# Altium schematic sheet Schematic.SchDoc
size A4; SheetNumber: 1; SheetTotal: 1
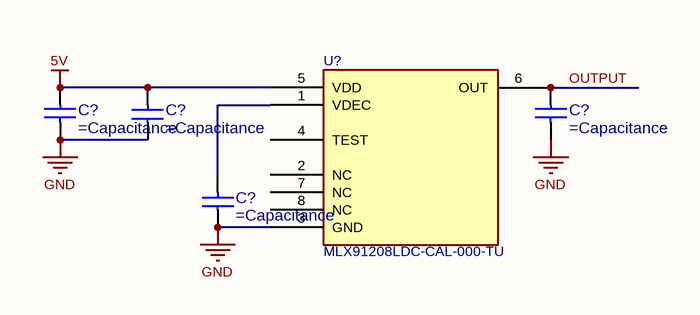
[diagram p0: Schematic.SchDoc]

## Parts
(Parts that share a designator on the sheet are numbered #1, #2 ... from top to bottom, then left to right.)
C?#1  (no value)  [C0402]
C?#2  (no value)  [C0402]
C?#3  (no value)  [C0402]
C?#4  (no value)  [C0402]
U?  MLX91208LDC-CAL-000-TU  [SOIC8]

## Nets
5V: C?#1.1 C?#3.2 U?.5(VDD)
GND: C?#1.2 C?#2.2 C?#3.1 C?#4.1 U?.3(GND)
OUTPUT: C?#2.1 U?.6(OUT)
NetC?#4_2: C?#4.2 U?.1(VDEC)

Not connected (* = marked no-connect by the designer): U? 2(NC) 4(TEST) 7(NC) 8(NC)

## Library data of the parts
C?#1 = CAP0402-4.7uF-10V: Ceramic Capacitor, Ceramic, 10V, 10% +Tol, 10% -Tol, X5R, 15% TC, 4.7uF, Surface Mount, 0402; Manufacturer: Yageo Group; Manufacturer Part Number: CC0402KRX5R6BB475; Capacitance: 4.7µF; Value: 4.7µF; Temperature Coefficient: 30ppm/°C; Supplier 1: DigiKey; Supplier Part Number 1: 13-CC0402KRX5R6BB475DKR-ND; Supplier: DigiKey; Supplier Part Number: 13-CC0402KRX5R6BB475DKR-ND; RoHS: Compliant; Category: Ceramic Capacitors; Pricing: 1=0,11, 10=0,063, 50=0,0438, 100=0,038, 500=0,02808, 1000=0,02628, 2500=0,02393, 5000=0,02325 (USD); Case/Package: 0402; China RoHS: Compliant; Dielectric: X5R; Dielectric Material: Ceramic; Halogen Free: Halogen Free; Height: 500µm; Lead Free: Lead Free; Length: 1mm; Lifecycle Status: Production; Material: Ceramic; Max Operating Temperature: 85°C; Min Operating Temperature: -55°C; Mounting Technology: Surface Mount; Number of Terminals: 2; REACH SVHC: Yes; Voltage Rating: 10V; Voltage Rating (DC): 10V; Width: 500µm; ComponentLink1URL: https://datasheet.octopart.com:443/CC0402KRX5R6BB475-Yageo-datasheet-170350636.pdf?src-supplier=Future+Electronics; ComponentLink1Description: https://datasheet.octopart.com:443/CC0402KRX5R6BB475-Yageo-datasheet-170350636.pdf?src-supplier=Future+Electronics; ComponentLink2URL: https://datasheet.octopart.com:443/CC0402KRX5R6BB475-Yageo-datasheet-82528541.pdf?src-supplier=Future+Electronics; ComponentLink2Description: https://datasheet.octopart.com:443/CC0402KRX5R6BB475-Yageo-datasheet-82528541.pdf?src-supplier=Future+Electronics; ComponentLink3URL: https://datasheet.octopart.com:443/CC0402KRX5R6BB475-Yageo-datasheet-78855684.pdf?src-supplier=Upverter; ComponentLink3Description: https://datasheet.octopart.com:443/CC0402KRX5R6BB475-Yageo-datasheet-78855684.pdf?src-supplier=Upverter; ComponentLink4URL: https://datasheet.octopart.com:443/CC0402KRX5R6BB475-Yageo-Group-datasheet-189192896.pdf?src-supplier=TME; ComponentLink4Description: https://datasheet.octopart.com:443/CC0402KRX5R6BB475-Yageo-Group-datasheet-189192896.pdf?src-supplier=TME; ComponentLink5URL: https://datasheet.octopart.com:443/CC0402KRX5R6BB475-Yageo-datasheet-182029407.pdf?src-supplier=Newark; ComponentLink5Description: https://datasheet.octopart.com:443/CC0402KRX5R6BB475-Yageo-datasheet-182029407.pdf?src-supplier=Newark; ComponentLink6URL: https://datasheet.octopart.com:443/CC0402KRX5R6BB475-Yageo-datasheet-158238148.pdf?src-supplier=Newark; ComponentLink6Description: https://datasheet.octopart.com:443/CC0402KRX5R6BB475-Yageo-datasheet-158238148.pdf?src-supplier=Newark; ComponentLink7URL: https://datasheet.octopart.com:443/CC0402KRX5R6BB475-Yageo-Group-datasheet-145016144.pdf?src-supplier=ODG+(Origin+Data+Global); ComponentLink7Description: https://datasheet.octopart.com:443/CC0402KRX5R6BB475-Yageo-Group-datasheet-145016144.pdf?src-supplier=ODG+(Origin+Data+Global); ComponentLink8URL: https://datasheet.octopart.com/CC0402KRX5R6BB475-Yageo-datasheet-86397281.pdf; ComponentLink8Description: https://datasheet.octopart.com/CC0402KRX5R6BB475-Yageo-datasheet-86397281.pdf; ComponentLink9URL: http://sigma.octopart.com:80/rohs_statement/Yageo-company-2.pdf?src-supplier=Compliance+Statements; ComponentLink9Description: http://sigma.octopart.com:80/rohs_statement/Yageo-company-2.pdf?src-supplier=Compliance+Statements; ComponentLink10URL: http://sigma.octopart.com:80/conflict_mineral_statement/Yageo-company-3.pdf?src-supplier=Compliance+Statements; ComponentLink10Description: http://sigma.octopart.com:80/conflict_mineral_statement/Yageo-company-3.pdf?src-supplier=Compliance+Statements
C?#2 = CAP0402-6.8nF-25V: Multilayer Ceramic Capacitors MLCC - SMD/SMT 25V 6800pF X7R 0402 10% AEC-Q200; Manufacturer: KEMET; Manufacturer Part Number: C0402C682K3RACAUTO; Capacitance: 6.8nF; Value: 6.8nF; Supplier 1: DigiKey; Supplier Part Number 1: 399-C0402C682K3RACAUTOCT-ND; Supplier: DigiKey; Supplier Part Number: 399-C0402C682K3RACAUTOCT-ND; RoHS: Compliant; Category: Ceramic Capacitors; Stock: 9600; Pricing: 1=0,26, 10=0,122, 50=0,075, 100=0,0595, 500=0,0515 (USD); Case/Package: 0402; China RoHS: Compliant; Dielectric: X7R; Dielectric Material: Ceramic; Height: 500µm; Length: 1mm; Lifecycle Status: Production; Material: Ceramic; Max Operating Temperature: 125°C; Min Operating Temperature: -55°C; Mounting Technology: Surface Mount; Pins: 2; Number of Terminals: 2; REACH SVHC: Yes; Voltage Rating: 25V; Voltage Rating (DC): 25V; Width: 500µm; ComponentLink1URL: https://datasheet.octopart.com:443/C0402C682K3RACAUTO-KEMET-datasheet-178087915.pdf?src-supplier=IHS; ComponentLink1Description: https://datasheet.octopart.com:443/C0402C682K3RACAUTO-KEMET-datasheet-178087915.pdf?src-supplier=IHS; ComponentLink2URL: https://datasheet.octopart.com:443/C0402C682K3RACAUTO-KEMET-datasheet-137357759.pdf?src-supplier=Upverter; ComponentLink2Description: https://datasheet.octopart.com:443/C0402C682K3RACAUTO-KEMET-datasheet-137357759.pdf?src-supplier=Upverter; ComponentLink3URL: https://datasheet.octopart.com:443/C0402C682K3RACAUTO-KEMET-datasheet-153706760.pdf?src-supplier=Electro+Sonic; ComponentLink3Description: https://datasheet.octopart.com:443/C0402C682K3RACAUTO-KEMET-datasheet-153706760.pdf?src-supplier=Electro+Sonic; ComponentLink4URL: https://datasheet.octopart.com:443/C0402C682K3RACAUTO-KEMET-datasheet-138896278.pdf?src-supplier=Farnell; ComponentLink4Description: https://datasheet.octopart.com:443/C0402C682K3RACAUTO-KEMET-datasheet-138896278.pdf?src-supplier=Farnell; ComponentLink5URL: https://datasheet.octopart.com/C0402C682K3RACAUTO-KEMET-datasheet-84169754.pdf; ComponentLink5Description: https://datasheet.octopart.com/C0402C682K3RACAUTO-KEMET-datasheet-84169754.pdf
C?#3 C?#4 = CAP0402-0.1uF-50V: Multilayer Ceramic Capacitors MLCC - SMD/SMT 50V 1000pF C0G 0402 2%; Manufacturer: Walsin Technologies; Manufacturer Part Number: 0402B104K500CT; Capacitance: 100nF; Material: 4241ConductorMaterial; Value: 100nF; Tolerance: 10%; Dielectric: 1511DielectricType; Supplier: Digikey; Supplier Part Number: 1292-1176-1-ND; RoHS: Yes; Category: Ceramic Capacitors; Stock: 109567; Pricing: 1=0,08, 10=0,005, 100=0,0032, 1000=0,0024 (USD); Mounting Technology: Surface Mount; Case/Package: 0402; Case Code (Imperial): 0402; Case Code (Metric): 1005; Min Operating Temperature: -55°C; Max Operating Temperature: 125°C; Packaging: Cut Tape; Voltage Rating: 50V; Series: -; Voltage Rating (DC): 50V; Height: 550um; RoHS Compliant: Yes; Lead Free: 5697LeadFree; ComponentLink1URL: http://datasheet.octopart.com/0402B104K500CT-Walsin-Technologies-datasheet-26371553.pdf?src-supplier=Arrow+Electronics; ComponentLink1Description: http://datasheet.octopart.com/0402B104K500CT-Walsin-Technologies-datasheet-26371553.pdf?src-supplier=Arrow+Electronics; ComponentLink2URL: http://datasheet.octopart.com/0402B104K500CT-Walsin-Technologies-datasheet-26371553.pdf?src-supplier=Verical; ComponentLink2Description: http://datasheet.octopart.com/0402B104K500CT-Walsin-Technologies-datasheet-26371553.pdf?src-supplier=Verical; ComponentLink3URL: http://www.passivecomponent.com/indexsea/0402B104K500CT-IE.pdf?src-supplier=Digikey; ComponentLink3Description: http://www.passivecomponent.com/indexsea/0402B104K500CT-IE.pdf?src-supplier=Digikey; ComponentLink4URL: http://datasheet.octopart.com/0402B104K500CT-Walsin-Technologies-datasheet-26371553.pdf?src-supplier=Rs; ComponentLink4Description: http://datasheet.octopart.com/0402B104K500CT-Walsin-Technologies-datasheet-26371553.pdf?src-supplier=Rs; ComponentLink5URL: https://datasheet.octopart.com/0402B104K500CT-Walsin-Technologies-datasheet-128065749.pdf?src-supplier=Future+Electronics; ComponentLink5Description: https://datasheet.octopart.com/0402B104K500CT-Walsin-Technologies-datasheet-128065749.pdf?src-supplier=Future+Electronics; ComponentLink6URL: http://datasheet.octopart.com/0402B104K500CT-Walsin-Technologies-datasheet-26371553.pdf?src-supplier=Farnell; ComponentLink6Description: http://datasheet.octopart.com/0402B104K500CT-Walsin-Technologies-datasheet-26371553.pdf?src-supplier=Farnell; ComponentLink7URL: http://datasheet.octopart.com/0402B104K500CT-Walsin-Technologies-datasheet-26371553.pdf?src-supplier=Newark; ComponentLink7Description: http://datasheet.octopart.com/0402B104K500CT-Walsin-Technologies-datasheet-26371553.pdf?src-supplier=Newark; ComponentLink8URL: http://datasheet.octopart.com/0402B104K500CT-Walsin-Technologies-datasheet-26371553.pdf?src-supplier=Mouser; ComponentLink8Description: http://datasheet.octopart.com/0402B104K500CT-Walsin-Technologies-datasheet-26371553.pdf?src-supplier=Mouser; ComponentLink9URL: http://datasheet.octopart.com/0402B104K500CT-Walsin-Technologies-datasheet-26371553.pdf?src-supplier=Digikey; ComponentLink9Description: http://datasheet.octopart.com/0402B104K500CT-Walsin-Technologies-datasheet-26371553.pdf?src-supplier=Digikey; ComponentLink10URL: https://datasheet.octopart.com/0402B104K500CT-Walsin-Technologies-datasheet-62066062.pdf?src-supplier=TME; ComponentLink10Description: https://datasheet.octopart.com/0402B104K500CT-Walsin-Technologies-datasheet-62066062.pdf?src-supplier=TME; ComponentLink11URL: http://datasheet.octopart.com/0402B104K500CT-Walsin-Technologies-datasheet-26371553.pdf?src-supplier=Freelance+Electronics; ComponentLink11Description: http://datasheet.octopart.com/0402B104K500CT-Walsin-Technologies-datasheet-26371553.pdf?src-supplier=Freelance+Electronics; ComponentLink12URL: http://datasheet.octopart.com/0402B104K500CT-Walsin-Technologies-datasheet-26371553.pdf?src-supplier=Component+Sense; ComponentLink12Description: http://datasheet.octopart.com/0402B104K500CT-Walsin-Technologies-datasheet-26371553.pdf?src-supplier=Component+Sense; ComponentLink13URL: http://datasheet.octopart.com/0402B104K500CT-Walsin-Technologies-datasheet-26371553.pdf?src-supplier=NAC+Semi; ComponentLink13Description: http://datasheet.octopart.com/0402B104K500CT-Walsin-Technologies-datasheet-26371553.pdf?src-supplier=NAC+Semi; ComponentLink14URL: https://datasheet.octopart.com/0402B104K500CT-Walsin-Technologies-datasheet-136037192.pdf?src-supplier=TECHDesign; ComponentLink14Description: https://datasheet.octopart.com/0402B104K500CT-Walsin-Technologies-datasheet-136037192.pdf?src-supplier=TECHDesign; Supplier 1: Digikey; Supplier Part Number 1: 1292-1176-1-ND; China RoHS: Compliant; Depth: 500µm; Dielectric Material: Ceramic; Length: 1mm; Lifecycle Status: Production; Pins: 2; Number of Terminals: 2; REACH SVHC: Yes; Termination: SMD/SMT; Thickness: 558.8µm; Width: 500µm; ComponentLink15URL: https://datasheet.octopart.com:443/C0402C102G5GACTU-KEMET-datasheet-178132257.pdf?src-supplier=IHS; ComponentLink15Description: https://datasheet.octopart.com:443/C0402C102G5GACTU-KEMET-datasheet-178132257.pdf?src-supplier=IHS; ComponentLink16URL: https://datasheet.octopart.com:443/C0402C102G5GAC7867-KEMET-datasheet-10540709.pdf?src-supplier=IHS; ComponentLink16Description: https://datasheet.octopart.com:443/C0402C102G5GAC7867-KEMET-datasheet-10540709.pdf?src-supplier=IHS; ComponentLink17URL: https://datasheet.octopart.com:443/C0402C102G5GACTU-KEMET-datasheet-137357759.pdf?src-supplier=Upverter; ComponentLink17Description: https://datasheet.octopart.com:443/C0402C102G5GACTU-KEMET-datasheet-137357759.pdf?src-supplier=Upverter; ComponentLink18URL: https://datasheet.octopart.com:443/C0402C102G5GACTU-KEMET-datasheet-149521574.pdf?src-supplier=Farnell; ComponentLink18Description: https://datasheet.octopart.com:443/C0402C102G5GACTU-KEMET-datasheet-149521574.pdf?src-supplier=Farnell; ComponentLink19URL: https://datasheet.octopart.com:443/C0402C102G5GACTU-KEMET-datasheet-102158736.pdf?src-supplier=Newark; ComponentLink19Description: https://datasheet.octopart.com:443/C0402C102G5GACTU-KEMET-datasheet-102158736.pdf?src-supplier=Newark; ComponentLink20URL: https://datasheet.octopart.com:443/C0402C102G5GACTU-KEMET-datasheet-68331921.pdf?src-supplier=element14+APAC; ComponentLink20Description: https://datasheet.octopart.com:443/C0402C102G5GACTU-KEMET-datasheet-68331921.pdf?src-supplier=element14+APAC; ComponentLink21URL: https://datasheet.octopart.com:443/C0402C102G5GACTU-KEMET-datasheet-178087919.pdf?src-supplier=element14+APAC; ComponentLink21Description: https://datasheet.octopart.com:443/C0402C102G5GACTU-KEMET-datasheet-178087919.pdf?src-supplier=element14+APAC; ComponentLink22URL: https://datasheet.octopart.com:443/C0402C102G5GACTU-KEMET-datasheet-157246123.pdf?src-supplier=Electro+Sonic; ComponentLink22Description: https://datasheet.octopart.com:443/C0402C102G5GACTU-KEMET-datasheet-157246123.pdf?src-supplier=Electro+Sonic; ComponentLink23URL: https://datasheet.octopart.com/C0402C102G5GACTU-KEMET-datasheet-84169754.pdf; ComponentLink23Description: https://datasheet.octopart.com/C0402C102G5GACTU-KEMET-datasheet-84169754.pdf; ComponentLink24URL: https://datasheet.octopart.com:443/C0402C102G5GACTU-Kemet-datasheet-11974058.pdf?src-supplier=Arrow+Electronics; ComponentLink24Description: https://datasheet.octopart.com:443/C0402C102G5GACTU-Kemet-datasheet-11974058.pdf?src-supplier=Arrow+Electronics
U? = MLX91208: Hall Effect Sensor, -10mT Min, 10mT Max, -2-2mA, Plastic/epoxy, Rectangular, 8 Pin, Surface Mount; Manufacturer: Melexis; Accuracy: 0.1%; Current Rating: 14mA; Frequency: 200kHz; Linearity: 0.75%; Max Junction Temperature (Tj): 155°C; Max Output current: 2mA; Max Supply Voltage: 5.5V; Min Supply Voltage: 4.5V; Number of Channels: 1; Operating Supply Current: 12mA; Output Configuration: Analog; Polarity: Bidirectional; Response Time: 3µs; Supplier 1: DigiKey; Supplier Part Number 1: MLX91208LDC-CAL-000-TU-ND; Supplier: DigiKey; Supplier Part Number: MLX91208LDC-CAL-000-TU-ND; Manufacturer Part Number: MLX91208LDC-CAL-000-TU; RoHS: Compliant; Category: Magnetic Sensors; Stock: 619; Pricing: 1=4,05, 5=3,624, 10=3,468, 25=3,28, 80=3,071, 160=2,96038, 560=2,78313, 1040=2,70527 (USD); Ambient Temperature Range High: 150°C; Case/Package: SOIC; Height: 1.64mm; Lead Free: Lead Free; Length: 4.89mm; Lifecycle Status: Production; Max Operating Temperature: 150°C; Max Supply Current: 14mA; Min Operating Temperature: -40°C; Mounting Technology: Surface Mount; Number of Terminals: 8; Output Current: 2mA; REACH SVHC: Yes; Sensing Method: Hall Effect; ComponentLink1URL: https://datasheet.octopart.com:443/MLX91208LDC-CAL-000-TU-Melexis-datasheet-180628137.pdf?src-supplier=IHS; ComponentLink1Description: https://datasheet.octopart.com:443/MLX91208LDC-CAL-000-TU-Melexis-datasheet-180628137.pdf?src-supplier=IHS; ComponentLink2URL: https://datasheet.octopart.com:443/MLX91208LDC-CAL-000-TU-Melexis-datasheet-62983323.pdf?src-supplier=Future+Electronics; ComponentLink2Description: https://datasheet.octopart.com:443/MLX91208LDC-CAL-000-TU-Melexis-datasheet-62983323.pdf?src-supplier=Future+Electronics; ComponentLink3URL: https://datasheet.octopart.com:443/MLX91208LDC-CAL-000-TU-Melexis-datasheet-31820421.pdf?src-supplier=Future+Electronics; ComponentLink3Description: https://datasheet.octopart.com:443/MLX91208LDC-CAL-000-TU-Melexis-datasheet-31820421.pdf?src-supplier=Future+Electronics